# EAGLE board Konekt_Dash_Pro (EAGLE 6.5.0), part 1 of 2
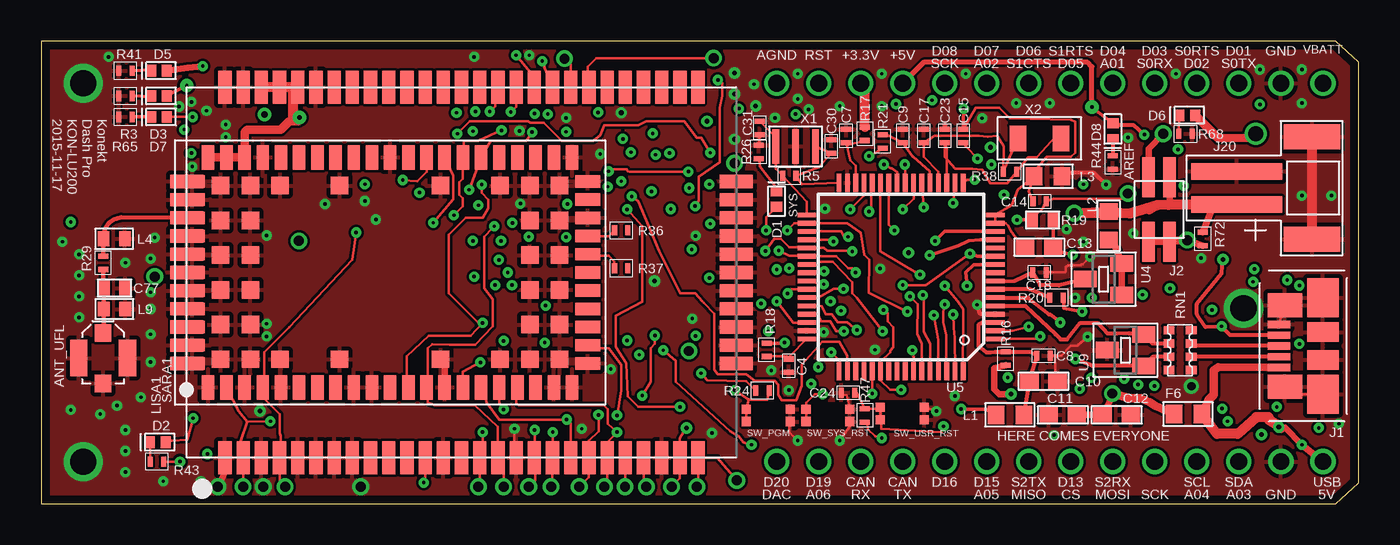
[diagram p5: board, top side]
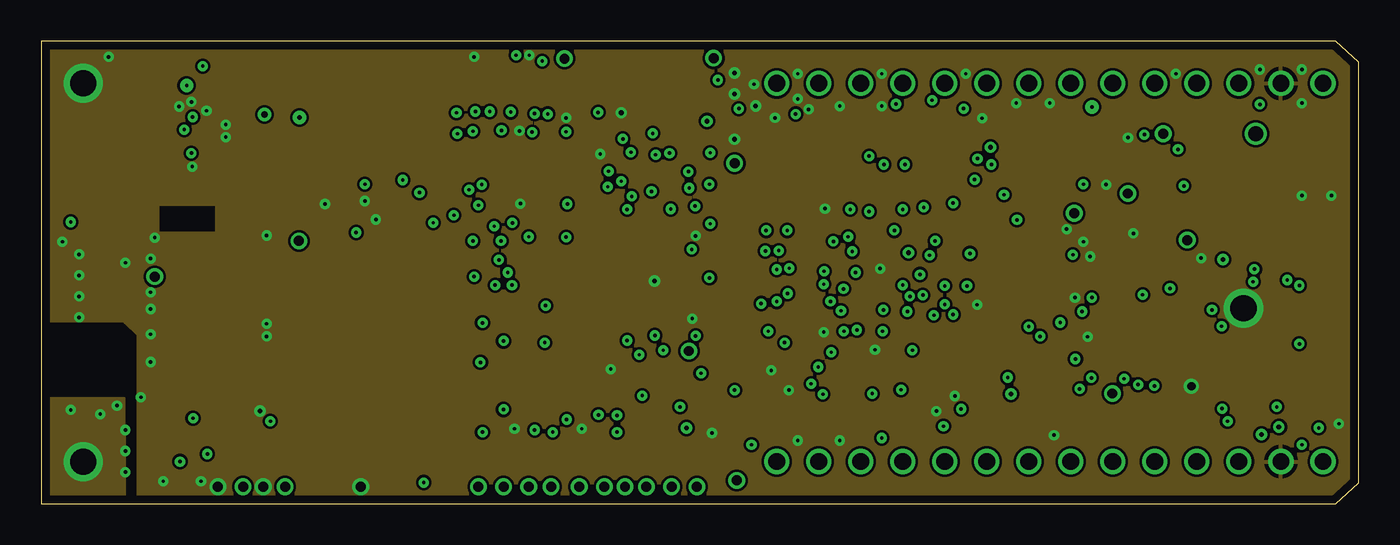
[diagram p6: board, inner layer Route2]
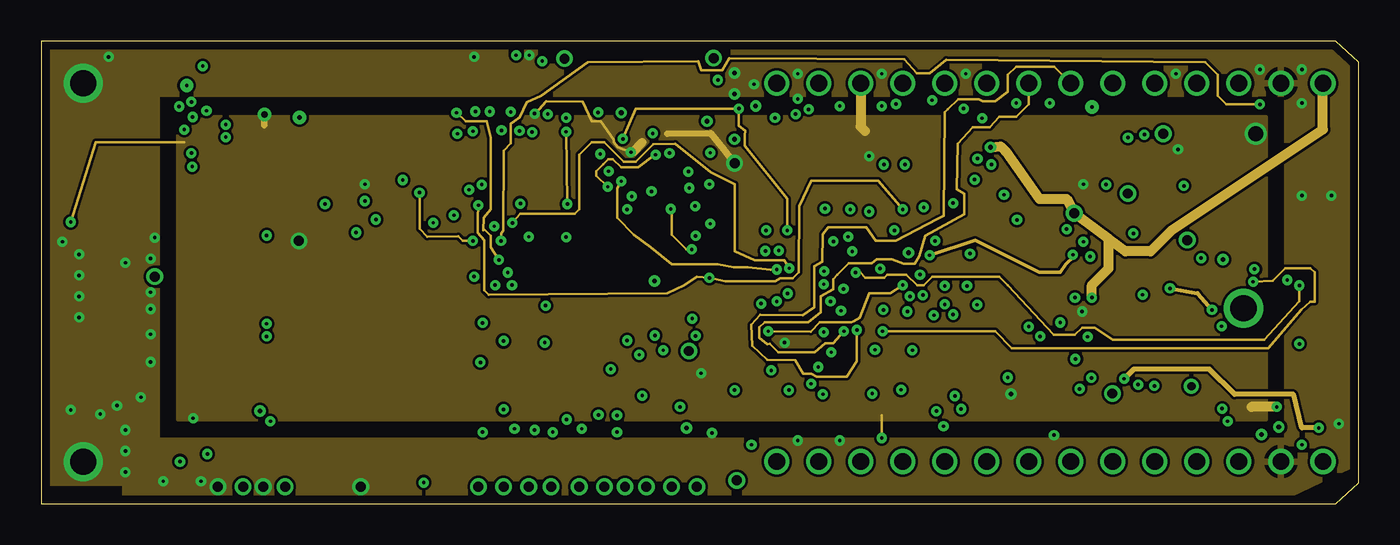
[diagram p7: board, inner layer none]
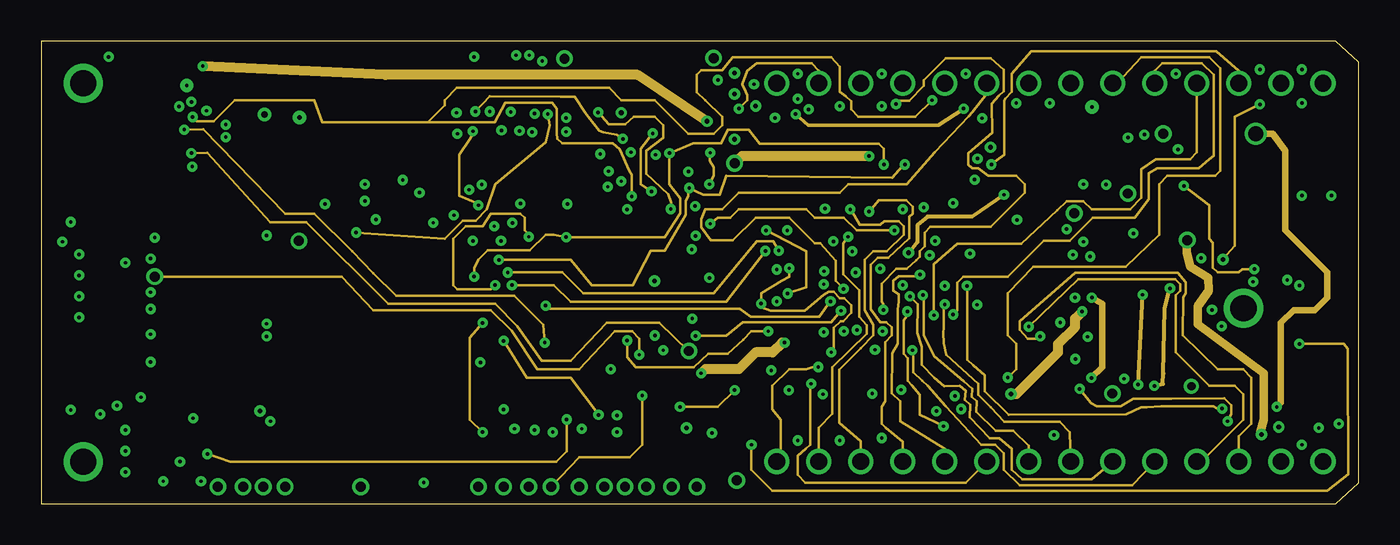
[diagram p8: board, inner layer Route14]
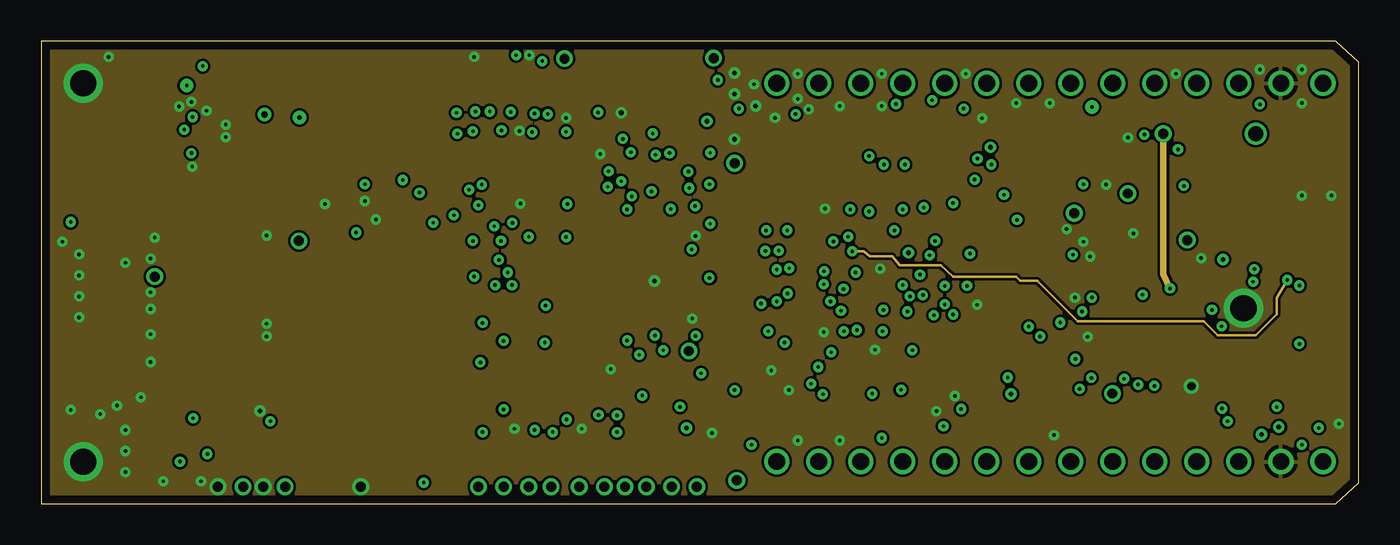
[diagram p9: board, inner layer Route15]
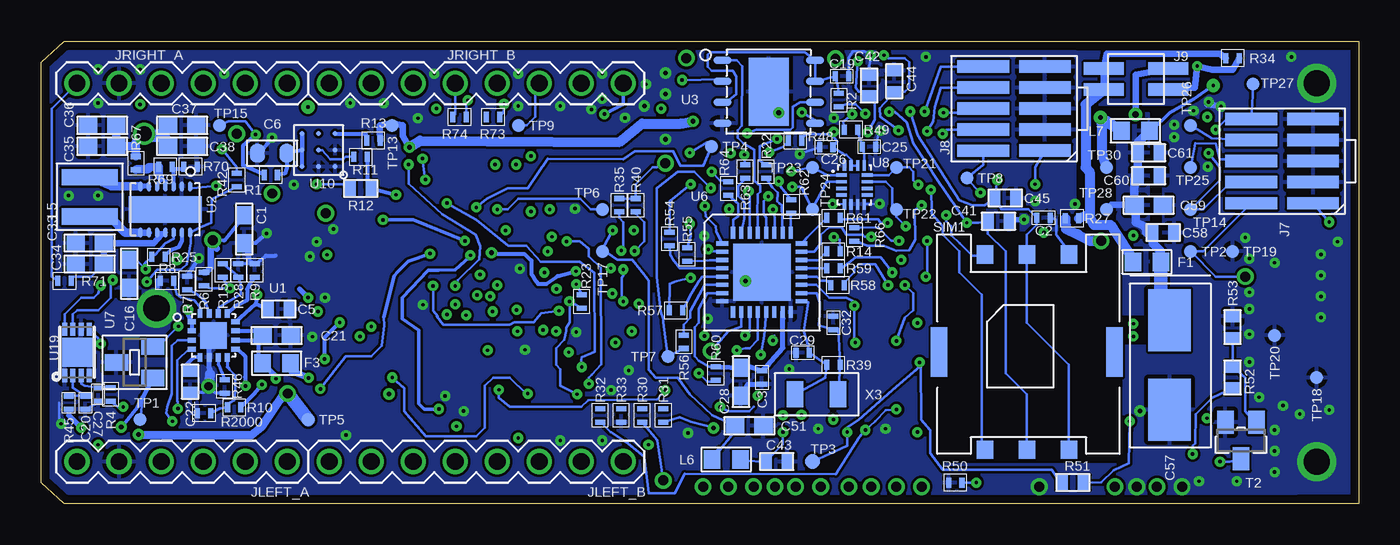
[diagram p10: board, bottom side, seen from below]

Size 79.63 x 27.94 mm. Coordinates in mm from the lower left corner, seen from the top.
Outline: 0,0 78.23,0 79.63,1.27 79.63,26.67 78.23,27.94 0,27.94 0,0
Copper layers (1*2*3*14*15*16): Top 0.01778125mm / dielectric 6.5mil / Route2 0.01778125mm / dielectric 0.5024125mm / none 0.01778125mm / dielectric 6.5mil / Route14 0.01778125mm / dielectric 0.5024125mm / Route15 0.01778125mm / dielectric 6.5mil / Bottom 0.01778125mm
Design rules "default *": minimum track width 6mil, minimum drill 8mil, track to track 6mil, track to pad 6mil, pad to pad 6mil, via to via 6mil, smd to smd 6mil, copper to edge 20mil, drill to drill 8mil, minimum pad ring 10mil, minimum via ring 8mil, stop-mask expansion 4mil, vias tented up to drill 0mil, thermal gap 10mil
Net classes: 1 power: width 0.406 mm, drill 0.61 mm, clearance 0.152 mm; 2 gnd: width 0.203 mm, drill 0.203 mm, clearance 0.152 mm; 3 usbvcc: width 0.203 mm, drill 0.61 mm, clearance 0.152 mm; 4 aref: width 0.203 mm, drill 0.61 mm, clearance 0.152 mm; 5 Vbatt: width 2.5 mm, drill 1 mm, clearance 0.125 mm; 6 HIGH_SPEED: width 0.155 mm, drill 0.203 mm, clearance 0.152 mm; 7 DIFF_HIGH_SPEED: width 0.157 mm, drill 0.203 mm, clearance 0.152 mm
tRestrict: area 9.9,16.5 to 10.1,17.7

## Footprints (pad centres in the part's own frame; a part is rotated, then mirrored left to right if it is on the bottom)
UFL = smd 2.2 x 1.05: GND1 0,1.475; GND2 0,-1.475 | smd 1.05 x 1: GND3 -1.525,0; SIGNAL 1.525,0
C0603 = smd 1.1 x 1: 1 -0.85,0; 2 0.85,0
C0402 = smd 0.305 x 0.61: 1 -0.406,0; 2 0.406,0
C0402' = smd 0.7 x 0.9: 1 -0.65,0; 2 0.65,0
C0603-ROUND = smd 0.898 x 1.1: 1 -0.889,0; 2 0.889,0
0402-CAP = smd 0.305 x 0.61: 1 -0.406,0; 2 0.406,0
CAPC1005X60N = smd 0.305 x 0.61: 1 -0.406,0; 2 0.406,0
CAP_SMD_SIZE_D = smd 3.75 x 2.55: P$1 -2.7,0; P$2 2.7,0
LED_0402_VISHAY_VLMW = smd 0.6 x 0.7: ANODE -0.475,0; CATHODE 0.475,0
R0603 = smd 1 x 1.1: 1 -0.85,0; 2 0.85,0
USB_MICRO_MOLEX_473460001 = smd 1.38 x 0.45: D+ 2.66,0; D- 2.66,0.65; GND 2.66,-1.3; ID 2.66,-0.65; VCC 2.66,1.3 | smd 1.9 x 2.375: GND$1 0,2.913; GND$4 0,-2.913 | smd 1.9 x 1.175: GND$2 0,0.838; GND$3 0,-0.838 | smd 2.1 x 1.475: GND$5 2.3,2.462; GND$6 2.3,-2.462
FCI_CON_1.27_2X2 = smd 0.76 x 2.4: 1 -0.635,-1.95; 2 -0.635,1.95; 3 0.635,-1.95; 4 0.635,1.95
FTS-105 = smd 0.74 x 3.125: 1 -2.54,-1.868; 2 -2.547,1.868; 3 -1.27,-1.868; 4 -1.27,1.868; 5 0,-1.868; 6 0,1.868; 7 1.27,-1.868; 8 1.27,1.868; 9 2.54,-1.868; 10 2.54,1.868
JST-PH-2 = smd 1 x 5.5: BAT 1,-1.75; GND -1,-1.75 | smd 1.5 x 3.4: CHASSIS1 -3.1,2.8; CHASSIS2 3.1,2.8
1X06 = drill 1.016: 1 -6.35,0; 2 -3.81,0; 3 -1.27,0; 4 1.27,0; 5 3.81,0; 6 6.35,0
HEADER_0.1_8_POS = drill 1.016: 1 -6.35,0; 2 -3.81,0; 3 -1.27,0; 4 1.27,0; 5 3.81,0; 6 6.35,0; 7 8.89,0; 8 11.43,0
R0603$1 = smd 1 x 1.1: 1 -0.85,0; 2 0.85,0
R0402 = smd 0.7 x 0.9: 1 -0.65,0; 2 0.65,0
COILCRAFT_XFL4020 = smd 0.98 x 3.4: P$1 -1.185,0; P$2 1.185,0
76PIN_LCC = smd 0.8 x 2: ANT -3.3,-16.6; GND$28 5.5,16.6; GND$29 4.4,16.6; GND$30 3.3,16.6; GND$31 2.2,16.6; GND$32 1.1,16.6; GND$33 0,16.6; GND$34 -1.1,16.6; GND$35 -2.2,16.6; GND$36 -3.3,16.6; GND$37 -4.4,16.6; GND$38 -5.5,16.6; GND$66 -5.5,-16.6; GND$67 -4.4,-16.6; GND$69 -2.2,-16.6; GND$70 -1.1,-16.6; GND$71 0,-16.6; GND$72 1.1,-16.6; GND$73 2.2,-16.6; GND$75 4.4,-16.6; N 5.5,-16.6; RSVD/ANT_DIV 3.3,-16.6 | smd 2 x 0.8: CTS 11.2,0; DCD 11.2,-3.3; DSR 11.2,-5.5; DTR 11.2,-2.2; GND$1 11.2,-14.3; GND$3 11.2,-12.1; GND$6 11.2,-8.8; GND$7 11.2,-7.7; GND$8 11.2,-6.6; GND$17 11.2,3.3; GND$25 11.2,12.1; GND$60 -11.2,-8.8; GND$64 -11.2,-13.2; GND$65 -11.2,-14.3; GPIO1 11.2,6.6; GPIO2 11.2,7.7; GPIO3 11.2,9.9; GPIO4 11.2,11; GPIO5 -11.2,1.1; GPIO6/I2S1_RXD -11.2,14.3; GPIO7/I2S1_TXD -11.2,13.2; GPIO8/I2S1_CLK -11.2,-1.1; GPIO9/I2S1_WA -11.2,-2.2; PWR_ON 11.2,5.5; RESET_N 11.2,8.8; RI 11.2,-4.4; RSVD 11.2,-9.9; RSVD/CODEC_CLK -11.2,0; RSVD/I2S_CLK -11.2,9.9; RSVD/I2S_RXD -11.2,8.8; RSVD/I2S_TXD -11.2,11; RSVD/I2S_WA -11.2,12.1; RTS 11.2,-1.1; RXD 11.2,2.2; SCL -11.2,7.7; SDA -11.2,6.6; SIM_CLK -11.2,5.5; SIM_IO -11.2,4.4; SIM_RST -11.2,3.3; SPI_MISO/GPIO12 -11.2,-5.5; SPI_MOSI/GPIO11 -11.2,-4.4; SPI_MRDY/GPIO14 -11.2,-7.7; SPI_SCLK/GPIO10 -11.2,-3.3; SPI_SRDY/GPIO13 -11.2,-6.6; TXD 11.2,1.1; USB_D+ 11.2,14.3; USB_D- 11.2,13.2; V_BCKP 11.2,-13.2; V_INT 11.2,-11; VCC$61 -11.2,-9.9; VCC$62 -11.2,-11; VCC$63 -11.2,-12.1; VSIM -11.2,2.2; VUSB_DET 11.2,4.4
0402-RES = smd 0.305 x 0.61: 1 -0.406,0; 2 0.406,0
CAY16 = smd 0.5 x 0.65: 1 -1.2,-0.675; 2 -0.4,-0.675; 3 0.4,-0.675; 4 1.2,-0.675; 5 1.2,0.675; 6 0.4,0.675; 7 -0.4,0.675; 8 -1.2,0.675
91-PIN_LGA = smd 1.5 x 0.75: 1 -6.95,11; 2 -6.95,9.9; 3 -6.95,8.8; 4 -6.95,7.7; 5 -6.95,6.6; 6 -6.95,5.5; 7 -6.95,4.4; 8 -6.95,3.3; 9 -6.95,2.2; 10 -6.95,1.1; 11 -6.95,0; 12 -6.95,-1.1; 13 -6.95,-2.2; 14 -6.95,-3.3; 15 -6.95,-4.4; 16 -6.95,-5.5; 17 -6.95,-6.6; 18 -6.95,-7.7; 19 -6.95,-8.8; 20 -6.95,-9.9; 21 -6.95,-11; 33 6.95,-11; 34 6.95,-9.9; 35 6.95,-8.8; 36 6.95,-7.7; 37 6.95,-6.6; 38 6.95,-5.5; 39 6.95,-4.4; 40 6.95,-3.3; 41 6.95,-2.2; 42 6.95,-1.1; 43 6.95,0; 44 6.95,1.1; 45 6.95,2.2; 46 6.95,3.3; 47 6.95,4.4; 48 6.95,5.5; 49 6.95,6.6; 50 6.95,7.7; 51 6.95,8.8; 52 6.95,9.9; 53 6.95,11 | smd 0.75 x 1.5: 22 -5.5,-11.95; 23 -4.4,-11.95; 24 -3.3,-11.95; 25 -2.2,-11.95; 26 -1.1,-11.95; 27 0,-11.95; 28 1.1,-11.95; 29 2.2,-11.95; 30 3.3,-11.95; 31 4.4,-11.95; 32 5.5,-11.95; 54 5.5,11.95; 55 4.4,11.95; 56 3.3,11.95; 57 2.2,11.95; 58 1.1,11.95; 59 0,11.95; 60 -1.1,11.95; 61 -2.2,11.95; 62 -3.3,11.95; 63 -4.4,11.95; 64 -5.5,11.95 | smd 1.05 x 1.05: 65 -5.25,10.25; 66 -3.15,10.25; 67 -1.05,10.25; 68 1.05,10.25; 69 3.15,10.25; 70 5.25,10.25; 71 -5.25,8.45; 72 -3.15,8.45; 73 -1.05,8.45; 74 1.05,8.45; 75 3.15,8.45; 76 5.25,8.45; 77 -5.25,6.65; 78 5.25,6.65; 79 -5.25,3.05; 80 5.25,3.05; 81 -5.25,-3.05; 82 5.25,-3.05; 83 -5.25,-6.65; 84 5.25,-6.65; 85 -5.25,-8.45; 86 -3.15,-8.45; 87 -1.05,-8.45; 88 1.05,-8.45; 89 3.15,-8.45; 90 5.25,-8.45; 91 -5.25,-10.25; 92 -3.15,-10.25; 93 -1.05,-10.25; 94 1.05,-10.25; 95 3.15,-10.25; 96 5.25,-10.25
SIM_CARD_NANO = smd 1 x 1.1: C1-VCC 6.94,-1.75; C2-RST 4.4,-1.75; C3-CLK 1.86,-1.75; C5-GND 6.94,10.05; C6-VPP 4.4,10.05; C7-IO 1.86,10.05 | smd 1 x 3: MTG1 9.7,4.15; MTG2 -0.9,4.15
SWITCH_PANASONIC_EVPBB = smd 0.55 x 0.55: A -1.325,0.375; A2 -1.325,-0.375; B 1.325,0.375; B2 1.325,-0.375
SOT23 = smd 1 x 1.4: 1 -0.95,-1.1; 2 0.95,-1.1; 3 0,1.1
TP08R = smd 0.8 x 0.8: TP 0,0
TP09R = smd 0.9 x 0.9: TP 0,0
BAT_CHARGE_ST_MICRO_L6924U = smd 0.3 x 0.5: 1 -0.825,-1.325; 2 -0.275,-1.325; 3 0.275,-1.325; 4 0.825,-1.325; 9 0.825,1.325; 10 0.275,1.325; 11 -0.275,1.325; 12 -0.825,1.325 | smd 0.5 x 0.3: 5 1.325,-0.825; 6 1.325,-0.275; 7 1.325,0.275; 8 1.325,0.825; 13 -1.325,0.825; 14 -1.325,0.275; 15 -1.325,-0.275; 16 -1.325,-0.825 | smd 1.6 x 1.6: PAD 0,0
QFN-14-POWERPAD3X4DSJ = smd 0.24 x 0.6: 1 -1.5,-1.4; 2 -1,-1.4; 3 -0.5,-1.4; 4 0,-1.4; 5 0.5,-1.4; 6 1,-1.4; 7 1.5,-1.4; 8 1.5,1.4; 9 1,1.4; 10 0.5,1.4; 11 0,1.4; 12 -0.5,1.4; 13 -1,1.4; 14 -1.5,1.4 | smd 4.4 x 1.58: POWERPAD 0,0
TDFN8_5X6 = smd 0.45 x 1.1: 1 -1.905,-2.8; 2 -0.635,-2.8; 3 0.635,-2.8; 4 1.905,-2.8; 5 1.905,2.8; 6 0.635,2.8; 7 -0.635,2.8; 8 -1.905,2.8 | smd 4.1 x 2.4: P$9 0,0
SOT23-3 = smd 1 x 1.4: 1 -0.95,-1.1; 2 0.95,-1.1; 3 0,1.1
MK20DX128VLH5 = smd 1.1 x 0.285: 1 -5.605,3.385; 2 -5.605,2.885; 3 -5.605,2.385; 4 -5.605,1.885; 5 -5.605,1.385; 6 -5.605,0.885; 7 -5.605,0.385; 8 -5.605,-0.115; 9 -5.605,-0.615; 10 -5.605,-1.115; 11 -5.605,-1.615; 12 -5.605,-2.115; 13 -5.605,-2.615; 14 -5.605,-3.115; 15 -5.605,-3.615; 16 -5.605,-4.115; 33 5.795,-4.115; 34 5.795,-3.615; 35 5.795,-3.115; 36 5.795,-2.615; 37 5.795,-2.115; 38 5.795,-1.615; 39 5.795,-1.115; 40 5.795,-0.615; 41 5.795,-0.115; 42 5.795,0.385; 43 5.795,0.885; 44 5.795,1.385; 45 5.795,1.885; 46 5.795,2.385; 47 5.795,2.885; 48 5.795,3.385 | smd 0.285 x 1.1: 17 -3.655,-6.065; 18 -3.155,-6.065; 19 -2.655,-6.065; 20 -2.155,-6.065; 21 -1.655,-6.065; 22 -1.155,-6.065; 23 -0.655,-6.065; 24 -0.155,-6.065; 25 0.345,-6.065; 26 0.845,-6.065; 27 1.345,-6.065; 28 1.845,-6.065; 29 2.345,-6.065; 30 2.845,-6.065; 31 3.345,-6.065; 32 3.845,-6.065; 49 3.845,5.335; 50 3.345,5.335; 51 2.845,5.335; 52 2.345,5.335; 53 1.845,5.335; 54 1.345,5.335; 55 0.845,5.335; 56 0.345,5.335; 57 -0.155,5.335; 58 -0.655,5.335; 59 -1.155,5.335; 60 -1.655,5.335; 61 -2.155,5.335; 62 -2.655,5.335; 63 -3.155,5.335; 64 -3.655,5.335
QFN_32_5X5 = smd 0.7 x 0.25: 1 -2.4,1.75; 2 -2.4,1.25; 3 -2.4,0.75; 4 -2.4,0.25; 5 -2.4,-0.25; 6 -2.4,-0.75; 7 -2.4,-1.25; 8 -2.4,-1.75; 17 2.4,-1.75; 18 2.4,-1.25; 19 2.4,-0.75; 20 2.4,-0.25; 21 2.4,0.25; 22 2.4,0.75; 23 2.4,1.25; 24 2.4,1.75 | smd 0.25 x 0.7: 9 -1.75,-2.4; 10 -1.25,-2.4; 11 -0.75,-2.4; 12 -0.25,-2.4; 13 0.25,-2.4; 14 0.75,-2.4; 15 1.25,-2.4; 16 1.75,-2.4; 25 1.75,2.4; 26 1.25,2.4; 27 0.75,2.4; 28 0.25,2.4; 29 -0.25,2.4; 30 -0.75,2.4; 31 -1.25,2.4; 32 -1.75,2.4 | smd 3.45 x 3.45: PAD 0,0
UQFN_16 = smd 0.2 x 0.65: P$1 -0.6,-0.775; P$2 -0.2,-0.775; P$3 0.2,-0.775; P$4 0.6,-0.775; P$9 0.6,0.775; P$10 0.2,0.775; P$11 -0.2,0.775; P$12 -0.6,0.775 | smd 0.65 x 0.2: P$5 1.175,-0.6; P$6 1.175,-0.2; P$7 1.175,0.2; P$8 1.175,0.6; P$13 -1.175,0.6; P$14 -1.175,0.2; P$15 -1.175,-0.2; P$16 -1.175,-0.6
MICRO_SIP_3X3 = smd 0.3 x 0.3: A1 -1,1; A2 0,1; A3 1,1; B1 -1,0; B2 0,0; B3 1,0; C1 -1,-1; C2 0,-1; C3 1,-1
TDFN-8 = smd 0.8 x 0.3: 1 -1.4,0.75; 2 -1.4,0.25; 3 -1.4,-0.25; 4 -1.4,-0.75; 5 1.4,-0.75; 6 1.4,-0.25; 7 1.4,0.25; 8 1.4,0.75 | smd 1.73 x 1.88: EP 0,0
CRYSTAL_RESONATOR_MURATA_CSTCE = smd 0.4 x 2.1: GND 0,0; XTAL1 -1.2,0; XTAL2 1.2,0
CRYSTAL_ST3215SB = smd 1 x 1.55: P$1 -1.3,0; P$2 1.3,0

## Placement (x,y rotation side)
ANT_UFL  ANT-A-1JB  [UFL]  3.73,8.79 90 top
C1  1 uF  [C0603]  67.36,16.59 270 bottom
C2  0.1 uF  [C0402]  19.05,17.27 0 bottom
C3  0.1 uF  [C0402]  36.07,7.62 270 bottom
C4  0.1 uF  [C0402]  45.19,8.33 270 top
C5  1 nF  [C0402']  65.28,11.76 0 bottom
C6  4.7u  [C0603-ROUND]  65.68,21.18 0 bottom
C7  0.1 uF  [C0402]  48.64,22.23 90 top
C8  0.1 uF  [C0402]  60.58,8.94 0 top
C9  0.1 uF  [C0402]  52.07,22.23 90 top
C10  2.2 uF  [C0603]  60.58,7.39 0 top
C11  2.2 uF  [C0603]  61.75,5.36 180 top
C12  0.1 uF  [C0603]  65,5.36 0 top
C13  2.2 uF  [C0603]  60.33,15.49 180 top
C14  0.1 uF  [C0402]  60.35,18.26 180 top
C15  0.1 uF  [C0402]  55.73,22.23 90 top
C16  0.1 uF  [C0603]  74.32,13.89 270 bottom
C17  15 pf  [C0402]  53.34,22.23 90 top
C18  0.1 uF  [C0402]  60.33,13.97 0 top
C19  0.1 uF  [C0402]  31.24,25.83 0 bottom
C20  1uF  [0402-CAP]  76.96,6.1 270 bottom
C21  1 uF  [C0603]  65.41,10.16 0 bottom
C22  10 nF  [C0402']  70.64,7.37 270 bottom
C23  15 pf  [C0402]  54.61,22.23 90 top
C24  0.1 uF  [C0402]  48.77,6.71 180 top
C25  0.1 uF  [C0402]  29.59,21.56 0 bottom
C26  0.1 uF  [C0402]  32.18,21.54 180 bottom
C27  10nF  [CAPC1005X60N]  76.2,6.6 90 bottom
C28  2.2 uF  [C0603]  37.34,7.37 270 bottom
C29  15 pf  [C0402]  33.6,9.12 180 bottom
C30  22 pf  [C0402]  47.75,21.59 90 top
C31  22 pf  [C0402]  43.43,22.71 270 top
C32  15 pf  [C0402]  31.75,10.92 90 bottom
C33  10 uF  [C0603]  76.71,15.75 180 bottom
C34  10 uF  [C0603]  76.71,14.48 180 bottom
C35  22 uF  [C0603]  75.95,21.59 180 bottom
C36  22 uF  [C0603]  75.95,22.86 180 bottom
C37  22 uF  [C0603]  71.12,22.86 0 bottom
C38  22 uF  [C0603]  71.12,21.59 0 bottom
C41  47 pF  [C0402']  21.77,17.07 0 bottom
C42  47 pF  [C0402']  29.59,25.27 90 bottom
C43  47 pF  [C0402']  35.18,2.54 0 bottom
C44  47 pF  [C0402']  28.07,25.53 90 bottom
C45  47 pF  [C0402']  21.36,18.47 0 bottom
C51  0.22 uF  [C0603]  36.83,4.7 0 bottom
C57  330 uF  [CAP_SMD_SIZE_D]  11.43,8.38 270 bottom
C58  10 nF  [C0402']  11.81,16.38 0 bottom
C59  0.1 uF  [C0603]  12.7,18.03 0 bottom
C60  15 pF  [C0402']  12.7,19.81 0 bottom
C61  68 pF  [C0402']  12.7,21.21 0 bottom
C77  DNI  [C0402']  4.42,13.03 0 top
D1  LED_0402_VLMW  [LED_0402_VISHAY_VLMW]  44.45,18.41 90 top
D2  LED_0402_VLMW  [LED_0402_VISHAY_VLMW]  7.04,3.71 180 top
D3  LED_0402_VLMW  [LED_0402_VISHAY_VLMW]  7.11,24.64 180 top
D5  LED_0402_VLMW  [LED_0402_VISHAY_VLMW]  7.11,26.16 180 top
D6  LED_0402_VLMW  [LED_0402_VISHAY_VLMW]  69.27,23.47 180 top
D7  LED_0402_VLMW  [LED_0402_VISHAY_VLMW]  7.11,23.37 180 top
D8  LED_0402_VLMW  [LED_0402_VISHAY_VLMW]  64.77,22.5 270 top
F1  3A  [R0603]  12.8,14.61 180 bottom
F3  3A  [R0603]  65.41,8.48 180 bottom
F6  3A  [R0603]  69.32,5.41 180 top
J1  USB_MICRO_B_MOLEX_473460001  [USB_MICRO_MOLEX_473460001]  77.47,9.53 180 top
J2  CON_JUMPER_1.27_2X2  [FCI_CON_1.27_2X2]  67.56,17.78 180 top
J7  FTS-105  [FTS-105]  4.62,20.7 90 bottom
J8  FTS-105  [FTS-105]  20.83,23.88 90 bottom
J9  CON_JUMPER_1.27_2X2  [FCI_CON_1.27_2X2]  13.46,25.65 270 bottom
J20  BAT_TERM  [JST-PH-2]  74.02,19.08 270 top
JB1  JUMPER_1.27MM  [NOTHING]  0,0 0 top
JB2  JUMPER_1.27MM  [NOTHING]  0,0 0 top
JLEFT_A  [1X06]  71.12,2.54 180 bottom
JLEFT_B  HEADER_0.1_IN_8_POS  [HEADER_0.1_8_POS]  50.8,2.54 180 bottom
JRIGHT_A  [1X06]  71.12,25.4 180 bottom
JRIGHT_B  HEADER_0.1_IN_8_POS  [HEADER_0.1_8_POS]  50.8,25.4 180 bottom
L1  INDUCTOR_0603  [R0603$1]  58.55,5.36 180 top
L2  INDUCTOR_0603  [R0603$1]  64.52,16.79 270 top
L3  INDUCTOR_0603  [R0603$1]  60.86,19.79 0 top
L4  INDUCTOR_0402  [R0402]  4.39,16 0 top
L5  1uH  [COILCRAFT_XFL4020]  76.71,18.54 90 bottom
L6  INDUCTOR_0603  [R0603$1]  38.23,2.67 180 bottom
L7  INDUCTOR_0603  [R0603$1]  13.49,22.53 180 bottom
L9  INDUCTOR_0402  [R0402]  4.42,11.76 0 top
LISA1  [76PIN_LCC]  25.4,13.97 270 top
R1  0  [0402-RES]  65.76,19.86 180 bottom
R2  0  [0402-RES]  31.42,24.38 270 bottom
R3  75  [0402-RES]  5.08,24.64 180 top
R4  0  [0402-RES]  75.44,6.6 90 bottom
R5  1M  [0402-RES]  45.21,19.81 0 top
R6  0  [0402-RES]  69.8,13.56 270 bottom
R7  24K  [0402-RES]  70.82,13.34 270 bottom
R8  24K  [0402-RES]  72.03,13.46 0 bottom
R9  3.3K  [0402-RES]  66.73,14.1 270 bottom
R10  1K  [0402-RES]  67.97,5.82 0 bottom
R11  0  [0402-RES]  60.33,20.95 180 bottom
R12  4.7K  [R0402]  60.33,19.05 0 bottom
R13  0  [0402-RES]  59.56,21.95 180 bottom
R14  0  [0402-RES]  31.75,15.24 0 bottom
R15  0  [0402-RES]  68.66,14.1 270 bottom
R16  0  [0402-RES]  58.29,8.76 90 top
R17  0  [0402-RES]  49.78,22.35 270 top
R18  0  [0402-RES]  43.84,9.3 270 top
R19  470  [R0402]  60.53,17.14 180 top
R20  0  [0402-RES]  61.37,12.45 180 top
R21  0  [0402-RES]  50.85,21.89 90 top
R22  0  [0402-RES]  35.81,20.07 90 bottom
R23  0  [0402-RES]  46.96,12.22 90 bottom
R24  10K  [0402-RES]  43.59,6.83 180 top
R25  0  [0402-RES]  72.54,14.91 0 bottom
R26  75  [0402-RES]  43.36,21.26 90 top
R27  0  [0402-RES]  17.32,17.25 0 bottom
R28  0  [0402-RES]  67.72,14.1 270 bottom
R29  0  [0402-RES]  3.73,14.55 90 top
R30  0  [0402-RES]  43.31,5.33 90 bottom
R31  0  [0402-RES]  42.04,5.33 90 bottom
R32  0  [0402-RES]  45.85,5.33 90 bottom
R33  0  [0402-RES]  44.58,5.33 90 bottom
R34  0  [0402-RES]  7.62,26.92 180 bottom
R35  10K  [0402-RES]  44.7,18.03 90 bottom
R36  0  [0402-RES]  35.05,16.51 180 top
R37  0  [0402-RES]  35.05,14.22 180 top
R38  1M  [0402-RES]  58.55,20.07 0 top
R39  1M  [0402-RES]  31.75,8.38 180 bottom
R40  10K  [0402-RES]  43.69,18.03 90 bottom
R41  75  [0402-RES]  5.08,26.16 180 top
R42  1M  [0402-RES]  67.82,19.56 90 bottom
R43  75  [0402-RES]  6.99,2.54 0 top
R44  75  [0402-RES]  64.77,20.62 270 top
R45  1k  [0402-RES]  77.98,6.1 270 bottom
R46  0  [0402-RES]  68.55,7.09 90 bottom
R47  10K  [0402-RES]  49.78,5.33 270 top
R48  0  [0402-RES]  34.06,21.95 0 bottom
R49  0  [0402-RES]  30.68,22.61 0 bottom
R50  0  [0402-RES]  24.38,1.27 180 bottom
R51  100K  [R0402]  17.27,1.27 0 bottom
R52  47K  [R0402]  7.62,7.62 90 bottom
R53  100K  [R0402]  7.62,10.67 90 bottom
R54  0  [0402-RES]  41.66,16 90 bottom
R55  0  [0402-RES]  40.59,15.06 90 bottom
R56  0  [0402-RES]  40.79,9.78 270 bottom
R57  0  [0402-RES]  41.27,11.68 180 bottom
R58  0  [0402-RES]  31.5,13.21 0 bottom
R59  0  [0402-RES]  31.75,14.22 0 bottom
R60  0  [0402-RES]  38.86,7.87 90 bottom
R61  0  [0402-RES]  31.75,17.27 180 bottom
R62  0  [0402-RES]  34.29,17.96 270 bottom
R63  0  [0402-RES]  37.08,20.07 270 bottom
R64  0  [0402-RES]  38.1,19.05 270 bottom
R65  75  [0402-RES]  5.08,23.37 180 top
R66  0  [0402-RES]  30.48,16.26 270 bottom
R67  0  [0402-RES]  73.91,20.57 90 bottom
R68  75  [0402-RES]  69.16,22.35 0 top
R69  0  [0402-RES]  72.14,20.37 180 bottom
R70  0  [0402-RES]  70.61,20.37 180 bottom
R71  0  [0402-RES]  78.23,13.46 0 bottom
R72  0  [0402-RES]  70.21,16 90 top
R73  0  [0402-RES]  52.32,23.37 180 bottom
R74  0  [0402-RES]  54.36,23.37 180 bottom
R2000  470  [0402-RES]  69.8,5.46 0 bottom
RN1  22R  [CAY16]  68.83,9.27 90 top
SARA1  SARA-U2XX  [91-PIN_LGA]  21.08,13.97 90 top
SIM1  SIM_CARD_NANO_GLOBAL_CONNECTOR_TEC_SIM8050-6-0-14-01-A  [SIM_CARD_NANO]  24.46,5 0 bottom
SW_PGM  SWITCH_PANASONIC_EVP-BB2A1B000  [SWITCH_PANASONIC_EVPBB]  43.94,5.33 0 top
SW_SYS_RST  SWITCH_PANASONIC_EVP-BB2A1B000  [SWITCH_PANASONIC_EVPBB]  47.55,5.33 0 top
SW_USR_RST  SWITCH_PANASONIC_EVP-BB2A1B000  [SWITCH_PANASONIC_EVPBB]  52.04,5.44 0 top
T2  BC846  [SOT23]  7.11,3.81 180 bottom
TP1  TPTP08R  [TP08R]  73.66,5.08 0 bottom
TP2  TPTP08R  [TP08R]  10.16,15.24 180 bottom
TP3  TPSTP09R  [TP09R]  33.02,2.54 0 bottom
TP4  TPTP08R  [TP08R]  39.12,21.59 0 bottom
TP5  TPTP08R  [TP08R]  63.5,5.08 0 bottom
TP6  TPTP08R  [TP08R]  45.72,17.78 0 bottom
TP7  TPTP08R  [TP08R]  41.76,8.89 0 bottom
TP8  TPTP08R  [TP08R]  23.67,19.68 0 bottom
TP9  TPTP08R  [TP08R]  50.8,22.86 0 bottom
TP13  TPTP08R  [TP08R]  58.42,22.86 270 bottom
TP14  TPTP08R  [TP08R]  10.16,17.78 180 bottom
TP15  TPTP08R  [TP08R]  68.86,22.86 270 bottom
TP17  TPTP08R  [TP08R]  45.72,15.24 270 bottom
TP18  TPTP08R  [TP08R]  2.54,7.62 270 bottom
TP19  TPTP08R  [TP08R]  7.62,15.24 270 bottom
TP20  TPTP08R  [TP08R]  5.08,10.16 270 bottom
TP21  TPTP08R  [TP08R]  27.94,20.32 180 bottom
TP22  TPTP08R  [TP08R]  27.94,17.78 180 bottom
TP23  TPTP08R  [TP08R]  33.02,20.32 180 bottom
TP24  TPTP08R  [TP08R]  33.02,17.78 180 bottom
TP25  TPTP08R  [TP08R]  10.16,20.32 180 bottom
TP26  TPTP08R  [TP08R]  10.16,22.86 180 bottom
TP27  TPTP08R  [TP08R]  6.38,25.37 180 bottom
TP28  TPTP08R  [TP08R]  15.24,17.78 0 bottom
TP30  TPTP08R  [TP08R]  15.24,20.32 0 bottom
U1  ST_MICRO_BAT_CHARGER_L6924U013  [BAT_CHARGE_ST_MICRO_L6924U]  69.22,10.16 270 bottom
U2  TPS63021  [QFN-14-POWERPAD3X4DSJ]  72.14,17.78 180 bottom
U3  MICROCHIP_FLASH_MEM  [TDFN8_5X6]  35.66,24.89 270 bottom
U4  DIODE_DUAL_SCHOTKEY  [SOT23-3]  64.21,13.56 90 top
U5  MK20DX128VLH5  [MK20DX128VLH5]  52.07,13.34 180 top
U6  FREESCALE_MKL17Z256VFM4  [QFN_32_5X5]  36.07,13.97 0 bottom
U7  PESD12VL2BT,215  [SOT23]  73.99,8.53 90 bottom
U8  VOLTAGE_TRANSLATOR_4_BIT  [UQFN_16]  30.48,19.25 270 bottom
U9  PESD12VL2BT,215  [SOT23]  65.53,9.27 90 top
U10  BOOST_5V_TI_TPS81256  [MICRO_SIP_3X3]  62.87,21.36 180 bottom
U19  MAX1704X  [TDFN-8]  77.47,9.14 90 bottom
X1  16 MHz  [CRYSTAL_RESONATOR_MURATA_CSTCE]  45.59,21.59 180 top
X2  32.768 kHz  [CRYSTAL_ST3215SB]  60.33,22.07 0 top
X3  32.768 kHz  [CRYSTAL_ST3215SB]  32.77,6.6 180 bottom